# Altium schematic sheet power-sheet.SchDoc: Power Regulator
size 420 x 297 mm; CheckedBy: E.Orzes F.Martina S.Baron; CompanyName: CERN; DrawnBy: E.Orzes; Organization: CERN; Address1: European Organization for Nuclear Research; Address2: CH-1211 Genève 23 - Switzerland; SheetNumber: 7; SheetTotal: 7; Projet: Phase Stable Link; DivGrp: EP-ESE; Designer: E.Orzes; ModifiedDate: -
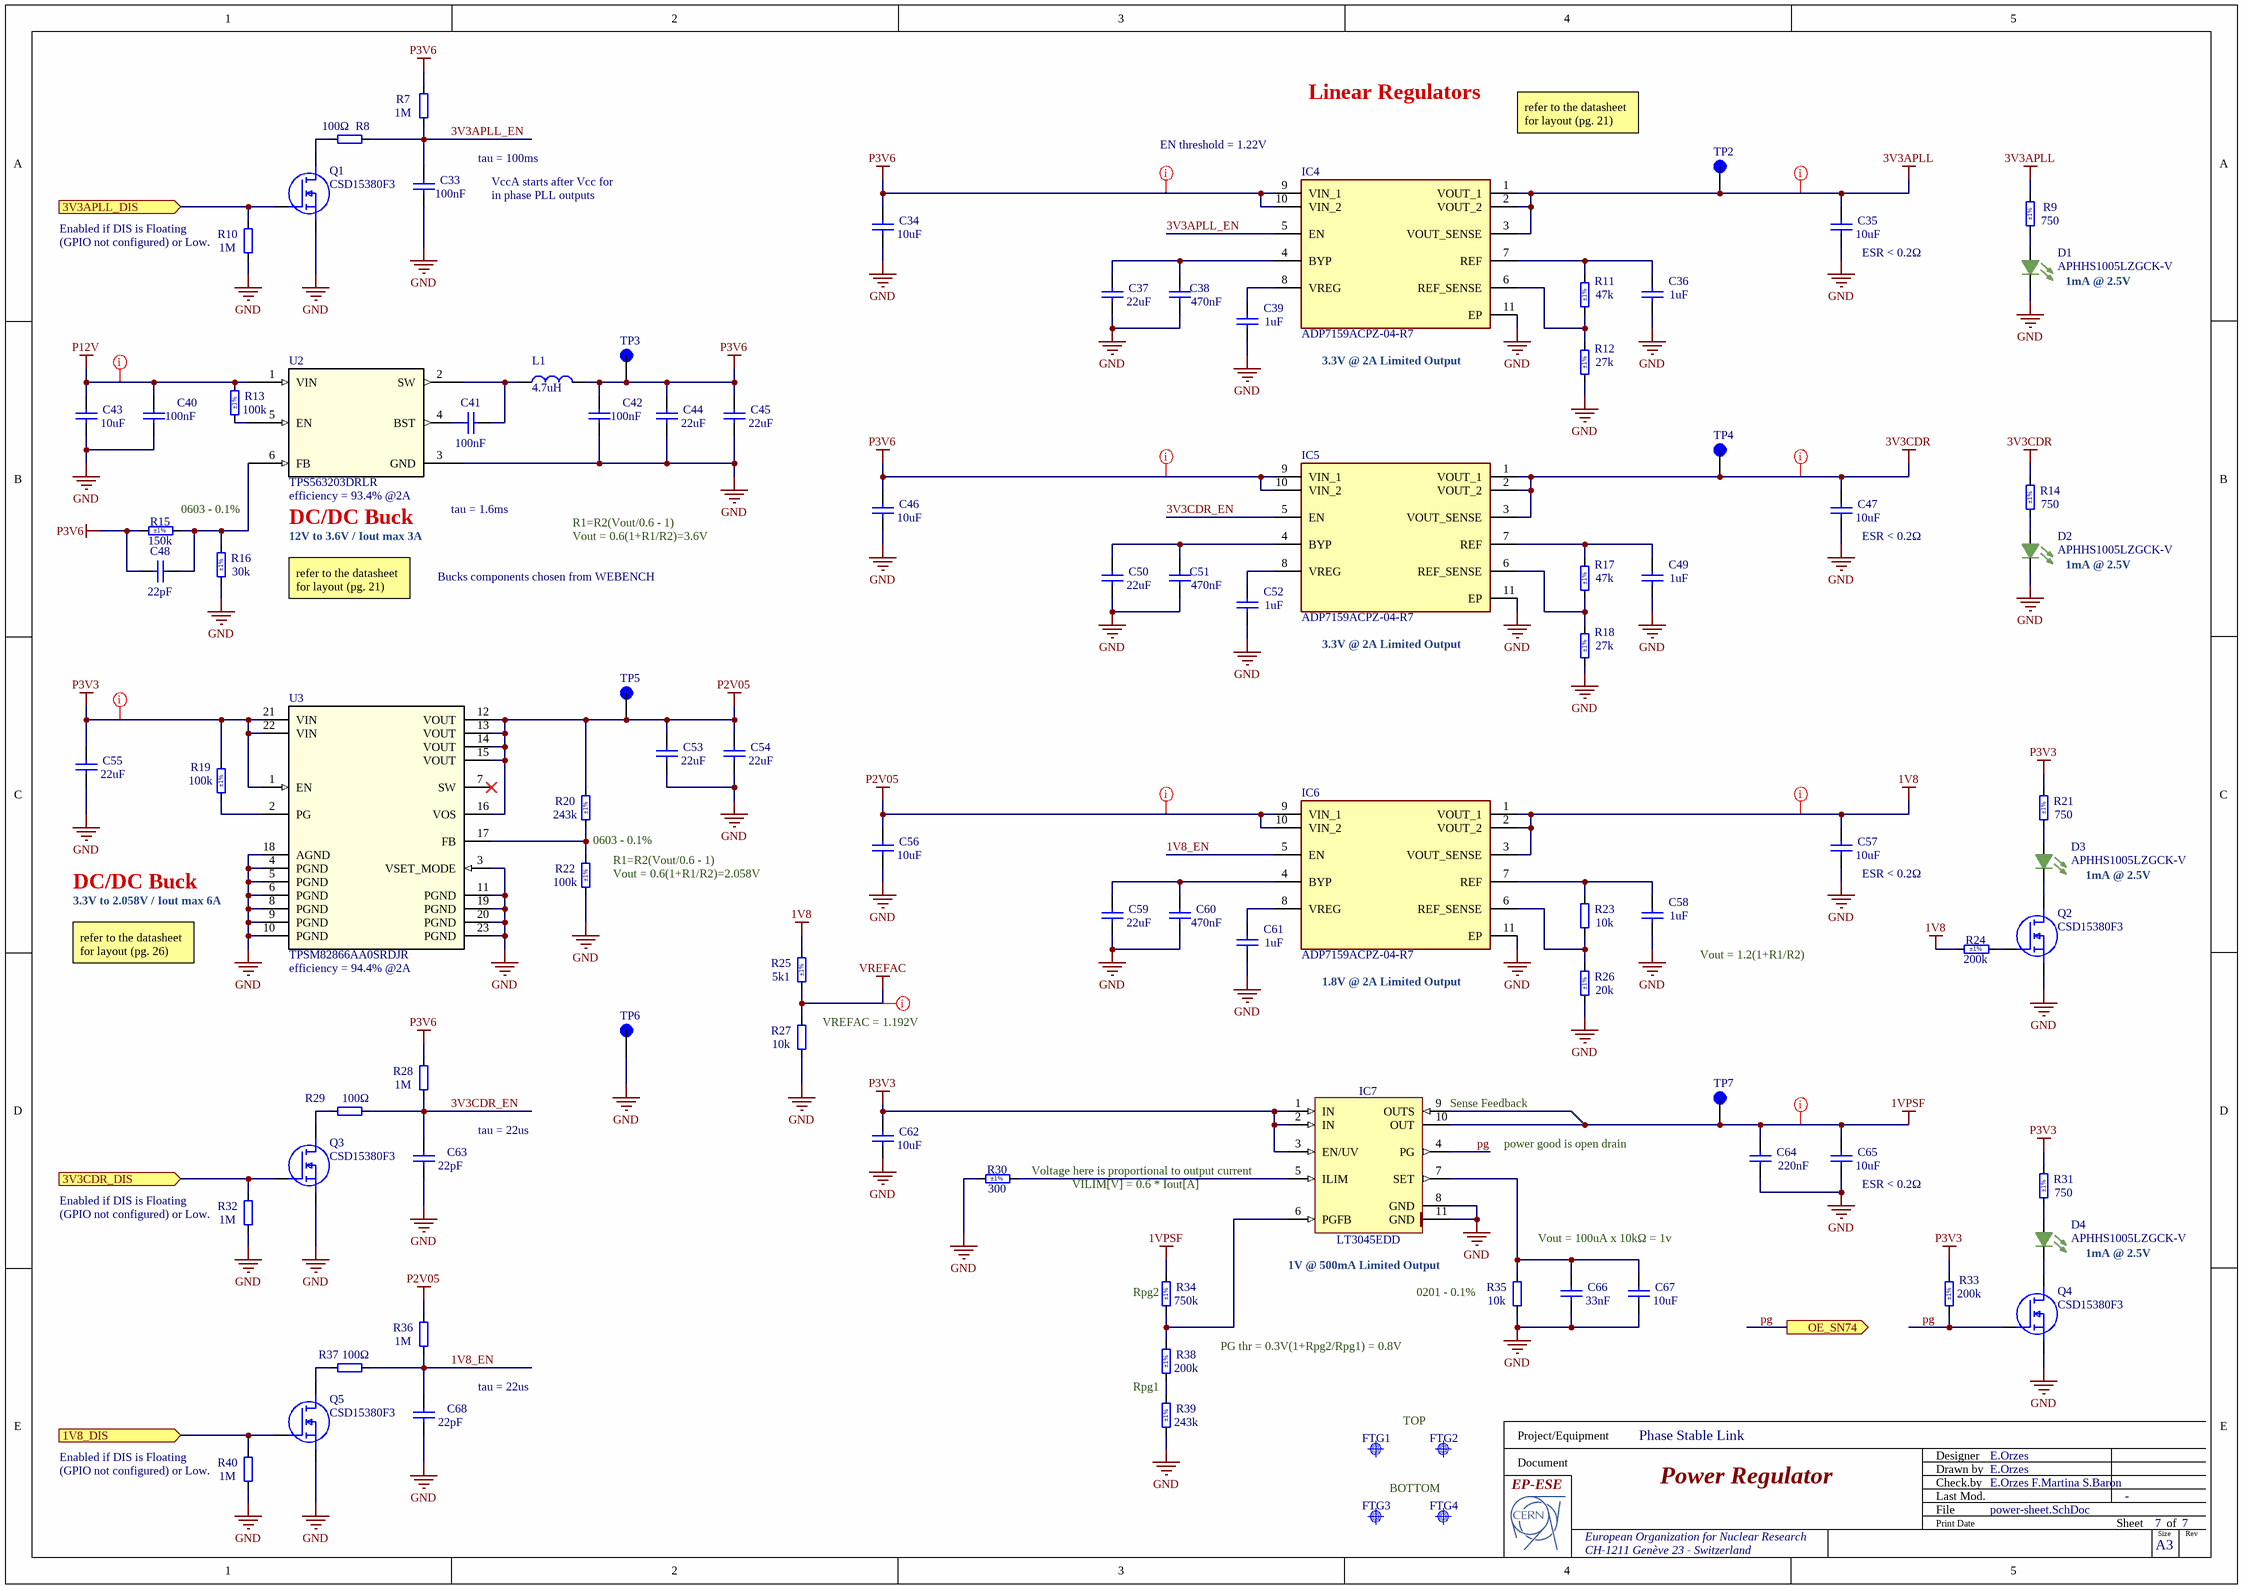
[diagram p0: power-sheet.SchDoc]

## Parts
C33  100nF  [MURATA_HI_DENSITY_0201]
C34  10uF  [CAPC1608X87N]
C35  10uF  [CAPC1608X87N]
C36  1uF  [CAPC1005X55N]
C37  22uF  [MURATA_HI_DENSITY_0402_CAP]
C38  470nF  [CAPC0510X04N]
C39  1uF  [CAPC1005X55N]
C40  100nF  [MURATA_HI_DENSITY_0402_CAP]
C41  100nF  [MURATA_HI_DENSITY_0402_CAP]
C42  100nF  [MURATA_HI_DENSITY_0402_CAP]
C43  10uF  [CAPC1608X87N]
C44  22uF  [MURATA_HI_DENSITY_0402_CAP]
C45  22uF  [MURATA_HI_DENSITY_0402_CAP]
C46  10uF  [CAPC1608X87N]
C47  10uF  [CAPC1608X87N]
C48  22pF  [MURATA_HI_DENSITY_0402_CAP]
C49  1uF  [CAPC1005X55N]
C50  22uF  [MURATA_HI_DENSITY_0402_CAP]
C51  470nF  [CAPC0510X04N]
C52  1uF  [CAPC1005X55N]
C53  22uF  [MURATA_HI_DENSITY_0402_CAP]
C54  22uF  [MURATA_HI_DENSITY_0402_CAP]
C55  22uF  [MURATA_HI_DENSITY_0402_CAP]
C56  10uF  [CAPC1608X87N]
C57  10uF  [CAPC1608X87N]
C58  1uF  [CAPC1005X55N]
C59  22uF  [MURATA_HI_DENSITY_0402_CAP]
C60  470nF  [CAPC0510X04N]
C61  1uF  [CAPC1005X55N]
C62  10uF  [CAPC1608X87N]
C63  22pF  [MURATA_HI_DENSITY_0402_CAP]
C64  220nF  [CAPC0603X33N]
C65  10uF  [CAPC1608X87N]
C66  33nF  [LLL03TR61E333KE01]
C67  10uF  [CAPC1608X87N]
C68  22pF  [MURATA_HI_DENSITY_0402_CAP]
D1  APHHS1005LZGCK-V  [LED_APHHS1005LZGCK-V]
D2  APHHS1005LZGCK-V  [LED_APHHS1005LZGCK-V]
D3  APHHS1005LZGCK-V  [LED_APHHS1005LZGCK-V]
D4  APHHS1005LZGCK-V  [LED_APHHS1005LZGCK-V]
FTG1  Use only in PCB  [FIDUCIAL_TOP_C100-200]  (value not drawn)
FTG2  Use only in PCB  [FIDUCIAL_TOP_C100-200]  (value not drawn)
FTG3  Use only in PCB  [FIDUCIAL_TOP_C100-200]  (value not drawn)
FTG4  Use only in PCB  [FIDUCIAL_TOP_C100-200]  (value not drawn)
IC4  ADP7159ACPZ-04-R7  [SON50P300X300X85-11N-D]
IC5  ADP7159ACPZ-04-R7  [SON50P300X300X85-11N-D]
IC6  ADP7159ACPZ-04-R7  [SON50P300X300X85-11N-D]
IC7  LT3045EDD  [SON50P300X300X80-11N-R175X248]
L1  4.7uH  [DFE322520FD1R0MP2]
Q1  CSD15380F3  [CSD15380F3]
Q2  CSD15380F3  [CSD15380F3]
Q3  CSD15380F3  [CSD15380F3]
Q4  CSD15380F3  [CSD15380F3]
Q5  CSD15380F3  [CSD15380F3]
R7  1M  [MURATA_HI_DENSITY_0201]
R8  100Ω  [MURATA_HI_DENSITY_0201]
R9  750  Tolerance: ±1%  [RESC1005X40N]
R10  1M  [MURATA_HI_DENSITY_0201]
R11  47k  Tolerance: ±1%  [RESC1005X40N]
R12  27k  Tolerance: ±1%  [RESC1005X40N]
R13  100k  Tolerance: ±1%  [RESC1608X55N]
R14  750  Tolerance: ±1%  [RESC1005X40N]
R15  150k  Tolerance: ±1%  [RESC1608X55N]
R16  30k  Tolerance: ±1%  [RESC1608X55N]
R17  47k  Tolerance: ±1%  [RESC1005X40N]
R18  27k  Tolerance: ±1%  [RESC1005X40N]
R19  100k  Tolerance: ±1%  [RESC1608X55N]
R20  243k  Tolerance: ±1%  [RESC1608X55N]
R21  750  Tolerance: ±1%  [RESC1005X40N]
R22  100k  Tolerance: ±1%  [RESC1608X55N]
R23  10k  [MURATA_HI_DENSITY_0201]
R24  200k  Tolerance: ±1%  [RESC1005X40N]
R25  5k1  Tolerance: ±1%  [RESC1005X40N]
R26  20k  Tolerance: ±1%  [RESC1005X40N]
R27  10k  [MURATA_HI_DENSITY_0201]
R28  1M  [MURATA_HI_DENSITY_0201]
R29  100Ω  [MURATA_HI_DENSITY_0201]
R30  300  Tolerance: ±1%  [RESC1005X40N]
R31  750  Tolerance: ±1%  [RESC1005X40N]
R32  1M  [MURATA_HI_DENSITY_0201]
R33  200k  Tolerance: ±1%  [RESC1005X40N]
R34  750k  Tolerance: ±1%  [RESC1005X40N]
R35  10k  [RESC0603X28N]
R36  1M  [MURATA_HI_DENSITY_0201]
R37  100Ω  [MURATA_HI_DENSITY_0201]
R38  200k  Tolerance: ±1%  [RESC1005X40N]
R39  243k  Tolerance: ±1%  [RESC1608X55N]
R40  1M  [MURATA_HI_DENSITY_0201]
TP2  RCU-0C  [TP+195X110]  (value not drawn)
TP3  RCU-0C  [TP+195X110]  (value not drawn)
TP4  RCU-0C  [TP+195X110]  (value not drawn)
TP5  RCU-0C  [TP+195X110]  (value not drawn)
TP6  RCU-0C  [TP+195X110]  (value not drawn)
TP7  RCU-0C  [TP+195X110]  (value not drawn)
U2  TPS563203DRLR  [SOT_07SDRLR_TEX]
U3  TPSM82866AA0SRDJR  [RDJ0023A-MFG]

## Ports
1V8_DIS (in), 3V3APLL_DIS (in), 3V3CDR_DIS (in), OE_SN74 (out)

## Nets
1V8: C57.2 IC6.1(VOUT_1) IC6.2(VOUT_2) IC6.3(VOUT_SENSE) R24.1 R25.2
1VPSF: C64.2 C65.2 IC7.9(OUTS) IC7.10(OUT) R34.2 TP7.1(TP)
3V3APLL: C35.2 IC4.1(VOUT_1) IC4.2(VOUT_2) IC4.3(VOUT_SENSE) R9.2 TP2.1(TP)
3V3CDR: C47.2 IC5.1(VOUT_1) IC5.2(VOUT_2) IC5.3(VOUT_SENSE) R14.2 TP4.1(TP)
GND: C33.1 C34.1 C35.1 C36.1 C37.1 C38.1 C39.1 C40.2 C42.2 C43.1 C44.1 C45.1 C46.1 C47.1 C49.1 C50.1 C51.1 C52.1 C53.1 C54.1 C55.1 C56.1 C57.1 C58.1 C59.1 C60.1 C61.1 C62.1 C63.2 C64.1 C65.1 C66.1 C67.1 C68.2 D1.1(C) D2.1(C) IC4.11(EP) IC5.11(EP) IC6.11(EP) IC7.8(GND) IC7.11(GND) Q1.2(S) Q2.2(S) Q3.2(S) Q4.2(S) Q5.2(S) R10.1 R12.1 R16.1 R18.1 R22.1 R26.1 R27.1 R30.1 R32.1 R35.1 R39.1 R40.1 TP6.1(TP) U2.3(GND) U3.3(VSET_MODE) U3.4(PGND) U3.5(PGND) U3.6(PGND) U3.8(PGND) U3.9(PGND) U3.10(PGND) U3.11(PGND) U3.18(AGND) U3.19(PGND) U3.20(PGND) U3.23(PGND)
P2V05: C53.2 C54.2 C56.2 IC6.9(VIN_1) IC6.10(VIN_2) R20.2 R36.2 TP5.1(TP) U3.12(VOUT) U3.13(VOUT) U3.14(VOUT) U3.15(VOUT) U3.16(VOS)
P3V3: C55.2 C62.2 IC7.1(IN) IC7.2(IN) IC7.3(EN/UV) R19.2 R21.2 R31.2 R33.2 U3.1(EN) U3.21(VIN) U3.22(VIN)
P3V6: C34.2 C42.1 C44.2 C45.2 C46.2 C48.2 IC4.9(VIN_1) IC4.10(VIN_2) IC5.9(VIN_1) IC5.10(VIN_2) L1.2 R7.2 R15.1 R28.2 TP3.1(TP)
P12V: C40.1 C43.2 R13.2 U2.1(VIN)
VREFAC: R25.1 R27.2
1V8_DIS: Q5.1(G) R40.2 ; port 1V8_DIS
1V8_EN: C68.1 IC6.5(EN) R36.1 R37.2
3V3APLL_DIS: Q1.1(G) R10.2 ; port 3V3APLL_DIS
3V3APLL_EN: C33.2 IC4.5(EN) R7.1 R8.2
3V3CDR_DIS: Q3.1(G) R32.2 ; port 3V3CDR_DIS
3V3CDR_EN: C63.1 IC5.5(EN) R28.1 R29.2
pg: IC7.4(PG) Q4.1(G) R33.1 ; port OE_SN74
NetC36_2: C36.2 IC4.7(REF) R11.2
NetC37_2: C37.2 C38.2 IC4.4(BYP)
NetC39_2: C39.2 IC4.8(VREG)
NetC41_1: C41.1 L1.1 U2.2(SW)
NetC41_2: C41.2 U2.4(BST)
NetC48_1: C48.1 R15.2 R16.2 U2.6(FB)
NetC49_2: C49.2 IC5.7(REF) R17.2
NetC50_2: C50.2 C51.2 IC5.4(BYP)
NetC52_2: C52.2 IC5.8(VREG)
NetC58_2: C58.2 IC6.7(REF) R23.2
NetC59_2: C59.2 C60.2 IC6.4(BYP)
NetC61_2: C61.2 IC6.8(VREG)
NetC66_2: C66.2 C67.2 IC7.7(SET) R35.2
NetD1_2: D1.2(A) R9.1
NetD2_2: D2.2(A) R14.1
NetD3_1: D3.1(C) Q2.3(D)
NetD3_2: D3.2(A) R21.1
NetD4_1: D4.1(C) Q4.3(D)
NetD4_2: D4.2(A) R31.1
NetIC4_6: IC4.6(REF_SENSE) R11.1 R12.2
NetIC5_6: IC5.6(REF_SENSE) R17.1 R18.2
NetIC6_6: IC6.6(REF_SENSE) R23.1 R26.2
NetIC7_5: IC7.5(ILIM) R30.2
NetIC7_6: IC7.6(PGFB) R34.1 R38.2
NetQ1_3: Q1.3(D) R8.1
NetQ2_1: Q2.1(G) R24.2
NetQ3_3: Q3.3(D) R29.1
NetQ5_3: Q5.3(D) R37.1
NetR13_1: R13.1 U2.5(EN)
NetR19_1: R19.1 U3.2(PG)
NetR20_1: R20.1 R22.2 U3.17(FB)
NetR38_1: R38.1 R39.2

Not connected (* = marked no-connect by the designer): U3 7(SW)*

## Layout directives
net class Power: 1V8, 1VPSF, 3V3APLL, 3V3CDR, P2V05, P3V3, P3V6, P12V, VREFAC

## Notes on the sheet
- Linear Regulators
- refer to the datasheet for layout (pg. 21)
- tau = 100ms
- (near IC4) EN threshold = 1.22V
- (near R10) Enabled if DIS is Floating (GPIO not configured) or Low.
- VccA starts after Vcc for in phase PLL outputs
- (near C35) ESR < 0.2Ω
- 1mA @ 2.5V
- (near IC4) 3.3V @ 2A Limited Output
- (near R15) 0603 - 0.1%
- (near U2) DC/DC Buck
- (near U2) efficiency = 93.4% @2A
- (near U2) tau = 1.6ms
- R1=R2(Vout/0.6 - 1)
- 12V to 3.6V / Iout max 3A
- Bucks components chosen from WEBENCH
- Vout = 0.6(1+R1/R2)=3.6V
- (near C47) ESR < 0.2Ω
- (near IC5) 3.3V @ 2A Limited Output
- 0603 - 0.1%
- DC/DC Buck
- (near U3) 3.3V to 2.058V / Iout max 6A
- (near R22) Vout = 0.6(1+R1/R2)=2.058V
- (near C57) ESR < 0.2Ω
- refer to the datasheet for layout (pg. 26)
- (near U3) efficiency = 94.4% @2A
- (near IC6) 1.8V @ 2A Limited Output
- Vout = 1.2(1+R1/R2)
- (near R27) VREFAC = 1.192V
- tau = 22us
- (near IC7) Sense Feedback
- (near IC7) Voltage here is proportional to output current
- VILIM[V] = 0.6 * Iout[A]
- power good is open drain
- (near C65) ESR < 0.2Ω
- (near R32) Enabled if DIS is Floating (GPIO not configured) or Low.
- (near IC7) 1V @ 500mA Limited Output
- Vout = 100uA x 10kΩ = 1v
- (near R34) Rpg2
- (near R35) 0201 - 0.1%
- Rpg1
- PG thr = 0.3V(1+Rpg2/Rpg1) = 0.8V
- TOP
- (near R40) Enabled if DIS is Floating (GPIO not configured) or Low.
- BOTTOM
- Project/Equipment
- Document
- Designer
- Drawn by
- Check.by
- File
- Last Mod.
- Print Date
- Sheet
- Size
- A3
- of
- Rev

## Library data of the parts
C33 = C0201-100nF-high-density: GRM033R61C104KE14; Vmax: 16V; Value: 100nF
C34 C35 C43 C46 C47 C56 C57 C62 C65 C67 = CC0603_10UF_6.3V_20%_X5R: C1608X5R1E106M080AC; Part Description: SMD Multilayer Chip Ceramic Capacitor; Manufacturer: GENERIC; Manufacturer1 Part Number: C0603C106M9PAC; Voltage: 6.3V; TC: X5R; Tolerance: ±20%; Part Number: CC0603_10UF_6.3V_20%_X5R; Component Kind: Standard; Component Type: Standard; Pin Count: 2; Value: 10uF; Status: Preferred; Manufacturer Part Number: CC0603_10uF_6.3V_20%_X5R; Case: 0603; Mounted: Yes; Socket: No; SMD: Yes; Sense: No; Manufacturer1 Example: KEMET; Manufacturer1 ComponentHeight: 0.95mm; HelpURL: \\cern.ch\dfs\Applications\Altium\Datasheets\CC0603_X5R_KEMET.pdf; Author: CERN DEM JLC; CreateDate: 03/12/2007; LatestRevisionDate: 03/12/2007
C36 C39 C49 C52 C58 C61 = CC0402_1UF_16V_10%_X5R: GRM153B30J105ME15; Part Description: SMD Multilayer Chip Ceramic Capacitor; Manufacturer: GENERIC; Manufacturer1 Part Number: C1005X5R1C105KT; Voltage: 16V; TC: X5R; Tolerance: ±10%; Part Number: CC0402_1UF_16V_10%_X5R; Component Kind: Standard; Component Type: Standard; Pin Count: 2; Value: 1uF; Status: Preferred; Manufacturer Part Number: CC0402_1UF_16V_10%_X5R; Case: 0402; Mounted: Yes; Socket: No; SMD: Yes; Sense: No; Manufacturer1 Example: TDK; Manufacturer1 ComponentHeight: 0.55mm; HelpURL: \\cern.ch\dfs\Applications\Altium\Datasheets\CC0402_X5R_TDK_C.pdf; Author: CERN DEM JLC; CreateDate: 10/25/2012; LatestRevisionDate: 10/25/2012
C37 C44 C45 C50 C53-C55 C59 = C0402-22uF-high-density: GRM155R60J226ME11; Vmax: 6.3V; Value: 22uF
C38 C51 C60 = Capacitor - non polarized: LLL153C70G474ME17; Value: 470nF
C40-C42 = C0402-22uF-high-density: GRM155R71E104KE14; Value: 22uF; Vmax: 6.3V
C48 C63 C68 = C0402-22uF-high-density: C0402C220J4GACTU; Value: 22uF; Vmax: 6.3V
C64 = CC0201_220NF_6.3V_10%_X7S_TDK_C0603X7S0J224K030: GRM033C80J224KE90D; Part Description: SMD Multilayer Chip Ceramic Capacitor; Manufacturer: TDK; Voltage: 6.3V; TC: X7S; Tolerance: ±10%; Part Number: CC0201_220NF_6.3V_10%_X7S_TDK_C0603X7S0J224K030; Component Kind: Standard; Component Type: Standard; Pin Count: 2; Value: 220nF; Status: Not Recommended; Manufacturer Part Number: C0603X7S0J224K030; Case: 0201; Mounted: Yes; Socket: No; SMD: Yes; Sense: No; ComponentHeight: 0.33mm; HelpURL: \\cern.ch\dfs\Applications\Altium\Datasheets\CC0201_X7S_TDK_C.pdf; Author: CERN DEM BC; CreateDate: 11/25/2020; LatestRevisionDate: 11/25/2020
C66 = Capacitor - non polarized: LLL03TR61E333KE01; Value: 33nF
D1-D4 = APHHS1005LZGCK-V: Led Green 0402 2mA 2.65V 40mcd 102mW; MF: Kingbright Corporation; SnapEDA_Link: https://www.snapeda.com/parts/APHHS1005LZGCK-V/Kingbright/view-part/?ref=snap; Package: 0402 Kingbright Corporation; Value: *; MP: APHHS1005LZGCK-V; Check_prices: https://www.snapeda.com/parts/APHHS1005LZGCK-V/Kingbright/view-part/?ref=eda
FTG1-FTG4 = FIDUCIAL_TARGET_C100-200: Fiducial Target; Part Description: Round Fiducial Target, Top Layer, 1.0mm, Top Solder 2.0mm, Keepout =2.0mm; Mounted: No; Part Number: FIDUCIAL_TARGET_C100-200; Component Kind: Standard (No BOM); Component Type: Standard (No BOM); Pin Count: 1; Family: Fiducial; Socket: No; SMD: Yes; Sense: No; Status: None; ComponentHeight: 0mm; HelpURL: Undefined; Author: CERN DEM JLC; CreateDate: 09/02/2010; LatestRevisionDate: 04/04/2012; PackageDescription: Round Fiducial Target, Top Layer, 1.0mm, Top Solder 2.0mm, Keepout =2.0mm
IC4-IC6 = ADP7159ACPZ-04-R7: Integrated Circuit; Manufacturer_Name: Analog Devices; Datasheet Link: https://www.analog.com/media/en/technical-documentation/data-sheets/ADP7159.pdf; Height: 0.85mm; Manufacturer_Part_Number: ADP7159ACPZ-04-R7; Mouser Part Number: 584-ADP7159ACPZ04R7; Mouser Price/Stock: https://www.mouser.co.uk/ProductDetail/Analog-Devices/ADP7159ACPZ-04-R7?qs=JeIcUl65ClBXEAZRPtHUVQ%3D%3D; Arrow Part Number: ADP7159ACPZ-04-R7; Arrow Price/Stock: https://www.arrow.com/en/products/adp7159acpz-04-r7/analog-devices
IC7 = LT3045EDD#PBF: 20V, 500mA, Ultralow Noise, Ultrahigh PSRR Linear Regulator; Manufacturer: LINEAR TECHNOLOGY; PressFit: No; Bonding: No; Part Number: LT3045EDD#PBF; Component Kind: Standard; Component Type: Standard; Device: LT3045EDD; PackageDescription: SON, 0.50mm Pitch; 10 Pin, 3.00mm W X 3.00mm L X 0.80mm H body (w/Thermal Tab 1.75 X 2.48 mm), IPC Medium Density; Part Description: 20V, 500mA, Ultralow Noise, Ultrahigh PSRR Linear Regulator; Manufacturer Part Number: LT3045EDD; Pin Count: 11; Case: SON10; Mounted: Yes; Socket: No; SMD: Yes; Sense: No; ComponentHeight: 0.8mm; HelpURL: \\cern.ch\dfs\Applications\Altium\Datasheets\LT3045EDD#PBF.pdf; Author: CERN DEM JLC; CreateDate: 07/12/2016; LatestRevisionDate: 03/02/2022
L1 = DFE322520FD-4R7M=P2: Inductor; Manufacturer_Name: Murata Electronics; Datasheet Link: https://search.murata.co.jp/Ceramy/image/img/P02/J(E)TE243A-9104.pdf; Height: 2mm; Manufacturer_Part_Number: DFE322520FD-4R7M=P2; Mouser Part Number: 81-DFE322520FD4R7MP2; Mouser Price/Stock: https://www.mouser.co.uk/ProductDetail/Murata-Electronics/DFE322520FD-4R7M%3dP2?qs=17u8i%2FzlE8%252BgAY54mivQ1g%3D%3D; Arrow Part Number: DFE322520FD-4R7M=P2; Arrow Price/Stock: https://www.arrow.com/en/products/dfe322520fd-4r7mp2/murata-manufacturing?region=nac
Q1-Q5 = CSD15380F3: MOSFET (N-Channel); Manufacturer_Name: Texas Instruments; Datasheet Link: https://www.ti.com/lit/ds/symlink/csd15380f3.pdf?ts=1641221366106&ref_url=https%253A%252F%252Fwww.google.com%252F; Height: 0.35mm; Manufacturer_Part_Number: CSD15380F3; Mouser Part Number: 595-CSD15380F3; Mouser Price/Stock: https://www.mouser.co.uk/ProductDetail/Texas-Instruments/CSD15380F3?qs=zEmsApcVOkXP46xhm0edmA%3D%3D; Arrow Part Number: CSD15380F3; Arrow Price/Stock: https://www.arrow.com/en/products/csd15380f3/texas-instruments?region=nac
R7 R10 R28 R32 R36 R40 = R0201-100ohm-high-density: Resistor 1M; Value: 100Ω
R8 R29 R37 = R0201-100ohm-high-density: Resistor; Value: 100Ω
R9 R14 R21 R31 = R0402_750R_1%_0.0625W_100PPM: Resistor - 1%; Part Description: General Purpose Thick Film Chip Resistor; Manufacturer: GENERIC; Manufacturer1 Part Number: 232270677501L; TC: ±100ppm/°C; PressFit: No; Part Number: R0402_750R_1%_0.0625W_100PPM; Component Kind: Standard; Component Type: Standard; Pin Count: 2; Value: 750; Status: Not Recommended; Power: 0.0625W; Manufacturer Part Number: R0402_750R_1%_0.0625W_100PPM; Case: 0402; Mounted: Yes; Sense: No; Socket: No; SMD: Yes; Manufacturer1 Example: YAGEO PHYCOMP; Manufacturer1 ComponentHeight: 0.4mm; HelpURL: \\cern.ch\dfs\Applications\Altium\Datasheets\R0402_Phycomp_RC0402.pdf; Author: CERN DEM JLC; CreateDate: 12/3/2007; LatestRevisionDate: 10/17/2012
R11 R17 = R0402_47K_1%_0.0625W_100PPM: Resistor - 1%; Part Description: General Purpose Thick Film Chip Resistor; Manufacturer: GENERIC; Manufacturer1 Part Number: 232270674703L; TC: ±100ppm/°C; PressFit: No; Part Number: R0402_47K_1%_0.0625W_100PPM; Component Kind: Standard; Component Type: Standard; Pin Count: 2; Value: 47k; Status: Not Recommended; Power: 0.0625W; Manufacturer Part Number: R0402_47K_1%_0.0625W_100PPM; Case: 0402; Mounted: Yes; Sense: No; Socket: No; SMD: Yes; Manufacturer1 Example: YAGEO PHYCOMP; Manufacturer1 ComponentHeight: 0.4mm; HelpURL: \\cern.ch\dfs\Applications\Altium\Datasheets\R0402_Phycomp_RC0402.pdf; Author: CERN DEM JLC; CreateDate: 12/3/2007; LatestRevisionDate: 10/17/2012
R12 R18 = R0402_27K_1%_0.0625W_100PPM: Resistor - 1%; Part Description: General Purpose Thick Film Chip Resistor; Manufacturer: GENERIC; Manufacturer1 Part Number: 232270672703L; TC: ±100ppm/°C; PressFit: No; Part Number: R0402_27K_1%_0.0625W_100PPM; Component Kind: Standard; Component Type: Standard; Pin Count: 2; Value: 27k; Status: Not Recommended; Power: 0.0625W; Manufacturer Part Number: R0402_27K_1%_0.0625W_100PPM; Case: 0402; Mounted: Yes; Sense: No; Socket: No; SMD: Yes; Manufacturer1 Example: YAGEO PHYCOMP; Manufacturer1 ComponentHeight: 0.4mm; HelpURL: \\cern.ch\dfs\Applications\Altium\Datasheets\R0402_Phycomp_RC0402.pdf; Author: CERN DEM JLC; CreateDate: 12/3/2007; LatestRevisionDate: 10/17/2012
R13 R19 R20 R22 R39 = R0603_30K_1%_0.1W_100PPM: Resistor - 1%; Part Description: General Purpose Thick Film Chip Resistor; Manufacturer: GENERIC; Manufacturer1 Part Number: NRC06F3002TRF; Value: 30k; Power: 0.1W; TC: ±100ppm/°C; PressFit: No; Part Number: R0603_30K_1%_0.1W_100PPM; Component Kind: Standard; Component Type: Standard; Pin Count: 2; Status: Preferred; Manufacturer Part Number: R0603_30K_1%_0.1W_100PPM; Case: 0603; Mounted: Yes; Sense: No; Socket: No; SMD: Yes; Manufacturer1 Example: NIC COMPONENT; Manufacturer1 ComponentHeight: 0.55mm; HelpURL: \\cern.ch\dfs\Applications\Altium\Datasheets\R0603_NIC_NRC.pdf; Author: CERN DEM JLC; CreateDate: 12/3/2007; LatestRevisionDate: 3/13/2008
R15 = R0603_150K_1%_0.1W_100PPM: Resistor - 1%; Part Description: General Purpose Thick Film Chip Resistor; Manufacturer: GENERIC; Manufacturer1 Part Number: NRC06F1503TRF; Power: 0.1W; TC: ±100ppm/°C; PressFit: No; Part Number: R0603_150K_1%_0.1W_100PPM; Component Kind: Standard; Component Type: Standard; Pin Count: 2; Value: 150k; Status: Preferred; Manufacturer Part Number: R0603_150K_1%_0.1W_100PPM; Case: 0603; Mounted: Yes; Sense: No; Socket: No; SMD: Yes; Manufacturer1 Example: NIC COMPONENT; Manufacturer1 ComponentHeight: 0.55mm; HelpURL: \\cern.ch\dfs\Applications\Altium\Datasheets\R0603_NIC_NRC.pdf; Author: CERN DEM JLC; CreateDate: 12/3/2007; LatestRevisionDate: 3/13/2008
R16 = R0603_30K_1%_0.1W_100PPM: Resistor - 1%; Part Description: General Purpose Thick Film Chip Resistor; Manufacturer: GENERIC; Manufacturer1 Part Number: NRC06F3002TRF; Power: 0.1W; TC: ±100ppm/°C; PressFit: No; Part Number: R0603_30K_1%_0.1W_100PPM; Component Kind: Standard; Component Type: Standard; Pin Count: 2; Value: 30k; Status: Preferred; Manufacturer Part Number: R0603_30K_1%_0.1W_100PPM; Case: 0603; Mounted: Yes; Sense: No; Socket: No; SMD: Yes; Manufacturer1 Example: NIC COMPONENT; Manufacturer1 ComponentHeight: 0.55mm; HelpURL: \\cern.ch\dfs\Applications\Altium\Datasheets\R0603_NIC_NRC.pdf; Author: CERN DEM JLC; CreateDate: 12/3/2007; LatestRevisionDate: 3/13/2008
R23 R27 = R0201-100ohm-high-density: Resistor 10k; Value: 100Ω
R24 R33 R38 = R0402_200K_1%_0.0625W_100PPM: Resistor - 1%; Part Description: General Purpose Thick Film Chip Resistor; Manufacturer: GENERIC; Manufacturer1 Part Number: 232270672004L; TC: ±100ppm/°C; PressFit: No; Part Number: R0402_200K_1%_0.0625W_100PPM; Component Kind: Standard; Component Type: Standard; Pin Count: 2; Value: 200k; Status: Not Recommended; Power: 0.0625W; Manufacturer Part Number: R0402_200K_1%_0.0625W_100PPM; Case: 0402; Mounted: Yes; Sense: No; Socket: No; SMD: Yes; Manufacturer1 Example: YAGEO PHYCOMP; Manufacturer1 ComponentHeight: 0.4mm; HelpURL: \\cern.ch\dfs\Applications\Altium\Datasheets\R0402_Phycomp_RC0402.pdf; Author: CERN DEM JLC; CreateDate: 12/3/2007; LatestRevisionDate: 10/17/2012
R25 = R0402_5K1_1%_0.0625W_100PPM: Resistor - 1%; Part Description: General Purpose Thick Film Chip Resistor; Manufacturer: GENERIC; Manufacturer1 Part Number: 232270675102L; TC: ±100ppm/°C; PressFit: No; Part Number: R0402_5K1_1%_0.0625W_100PPM; Component Kind: Standard; Component Type: Standard; Pin Count: 2; Value: 5k1; Status: Not Recommended; Power: 0.0625W; Manufacturer Part Number: R0402_5K1_1%_0.0625W_100PPM; Case: 0402; Mounted: Yes; Sense: No; Socket: No; SMD: Yes; Manufacturer1 Example: YAGEO PHYCOMP; Manufacturer1 ComponentHeight: 0.4mm; HelpURL: \\cern.ch\dfs\Applications\Altium\Datasheets\R0402_Phycomp_RC0402.pdf; Author: CERN DEM JLC; CreateDate: 03/12/2007; LatestRevisionDate: 17/10/2012
R26 = R0402_20K_1%_0.0625W_100PPM: Resistor - 1%; Part Description: General Purpose Thick Film Chip Resistor; Manufacturer: GENERIC; Manufacturer1 Part Number: 232270672003L; TC: ±100ppm/°C; PressFit: No; Part Number: R0402_20K_1%_0.0625W_100PPM; Component Kind: Standard; Component Type: Standard; Pin Count: 2; Value: 20k; Status: Not Recommended; Power: 0.0625W; Manufacturer Part Number: R0402_20K_1%_0.0625W_100PPM; Case: 0402; Mounted: Yes; Sense: No; Socket: No; SMD: Yes; Manufacturer1 Example: YAGEO PHYCOMP; Manufacturer1 ComponentHeight: 0.4mm; HelpURL: \\cern.ch\dfs\Applications\Altium\Datasheets\R0402_Phycomp_RC0402.pdf; Author: CERN DEM JLC; CreateDate: 12/3/2007; LatestRevisionDate: 10/17/2012
R30 = R0402_300R_1%_0.0625W_100PPM: Resistor - 1%; Part Description: General Purpose Thick Film Chip Resistor; Manufacturer: GENERIC; Manufacturer1 Part Number: 232270673001L; TC: ±100ppm/°C; PressFit: No; Part Number: R0402_300R_1%_0.0625W_100PPM; Component Kind: Standard; Component Type: Standard; Pin Count: 2; Value: 300; Status: Not Recommended; Power: 0.0625W; Manufacturer Part Number: R0402_300R_1%_0.0625W_100PPM; Case: 0402; Mounted: Yes; Sense: No; Socket: No; SMD: Yes; Manufacturer1 Example: YAGEO PHYCOMP; Manufacturer1 ComponentHeight: 0.4mm; HelpURL: \\cern.ch\dfs\Applications\Altium\Datasheets\R0402_Phycomp_RC0402.pdf; Author: CERN DEM JLC; CreateDate: 03/12/2007; LatestRevisionDate: 17/10/2012
R34 = R0402_750K_1%_0.0625W_100PPM: Resistor - 1%; Part Description: General Purpose Thick Film Chip Resistor; Manufacturer: GENERIC; Manufacturer1 Part Number: 232270677504L; TC: ±100ppm/°C; PressFit: No; Part Number: R0402_750K_1%_0.0625W_100PPM; Component Kind: Standard; Component Type: Standard; Pin Count: 2; Value: 750k; Status: Not Recommended; Power: 0.0625W; Manufacturer Part Number: R0402_750K_1%_0.0625W_100PPM; Case: 0402; Mounted: Yes; Sense: No; Socket: No; SMD: Yes; Manufacturer1 Example: YAGEO PHYCOMP; Manufacturer1 ComponentHeight: 0.4mm; HelpURL: \\cern.ch\dfs\Applications\Altium\Datasheets\R0402_Phycomp_RC0402.pdf; Author: CERN DEM JLC; CreateDate: 03/12/2007; LatestRevisionDate: 17/10/2012
R35 = R0201_0R_JUMPER: Resistor; Part Description: 1A (0.05R Max DC Resistance) Zero Ohm Jumper; Manufacturer: GENERIC; Manufacturer1 Part Number: CRCW02010000Z0ED; Value: 0; PressFit: No; Part Number: R0201_0R_JUMPER; Component Kind: Standard; Component Type: Standard; Pin Count: 2; Status: Not Recommended; Manufacturer Part Number: R0201_0R_JUMPER; Case: 0201; Mounted: Yes; Sense: No; Socket: No; SMD: Yes; Manufacturer1 Example: VISHAY; Manufacturer1 ComponentHeight: 0.27mm; HelpURL: \\cern.ch\dfs\Applications\Altium\Datasheets\R0201_VISHAY_CRCW e3.pdf; Author: CERN DEM JLC; CreateDate: 19/11/2014; LatestRevisionDate: 08/01/2015
TP2-TP7 = RCU-0C: MF: {'manufacturer': u'TE Connectivity AMP Connectors'}; Package: None; Price: None; Value: *; MP: RCU-0C; Availability: Unavailable
U2 = TPS563203DRLR: No Description Available; Mfr_Name: Texas Instruments; Type: Power Management; RefDes: RefDes
U3 = XPSM82866AA0SRDJR: No Description Available; Mfr_Name: Texas Instruments; TYPE: TYPE; RefDes: RefDes